# Altium schematic sheet MAX8510EXK30+T.SchDoc
size A; SheetNumber: 1; SheetTotal: 1
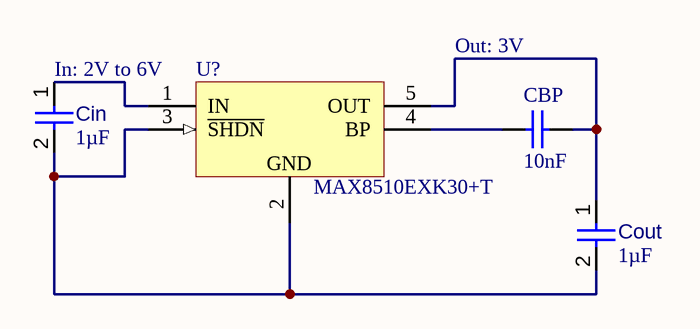
[diagram p0: MAX8510EXK30+T.SchDoc]

## Parts
CBP  10nF  [CAPC1608X92X38LL15T08]
Cin  value 1µF  [CAPC1608X94X35NL15T15]  (hidden comment: Capacitor 1 uF +/- 10% 16 V 0603)
Cout  value 1µF  [CAPC1608X94X35NL15T15]  (hidden comment: Capacitor 1 uF +/- 10% 16 V 0603)
U?  MAX8510EXK30+T  [X5-1_N]

## Nets
NetCBP_1: CBP.1 U?.4(BP)
NetCBP_2: CBP.2 Cout.1 U?.5(OUT)
NetCin_1: Cin.1 U?.1(IN)
NetCin_2: Cin.2 Cout.2 U?.2(GND) U?.3(~{SHDN})

## Notes on the sheet
- In: 2V to 6V
- Out: 3V

## Library data of the parts
CBP = CMP-2006-01201-1: Manufacturer: Vitramon; Part Number: VJ0603Y103JXXAC
Cin Cout = CMP-001-00003-6: Chip Capacitor, 1 uF, +/- 10%, 16 V, 0603 (1608 Metric); Voltage Rating: 16V; Capacitor Type: Ceramic; Max Operating Temperature: 125°C; Pins: 2; Tolerance: 10%; Min Operating Temperature: -55°C; RoHS Compliant: True; Mounting Technology: SM; Case/Package: 0603
U? = CMP-0246-00522-1: Ultra-Low-Noise, High PSRR, Low-Dropout, 120mA Linear Regulator, 3V Out, 5-Pin SC70, -40°C to +85°C; ComponentLink1Description: Manufacturer URL; ComponentLink2URL: http://datasheets.maxim-ic.com/en/ds/MAX8510-MAX8512.pdf; PackageDescription: 5-Pin SC70 Transistor Package, 0.65 mm Pitch, 2.2 mm Lead Span; ComponentLink3Description: Package Specification; ComponentLink1URL: http://www.maxim-ic.com; ComponentLink3URL: http://pdfserv.maxim-ic.com/package_dwgs/21-0076.PDF; PackageVersion: revE, 2006; PackageReference: X5-1; Code_JEDEC: MO-203; ComponentLink2Description: Datasheet; DatasheetVersion: Rev 4, Aug-2011